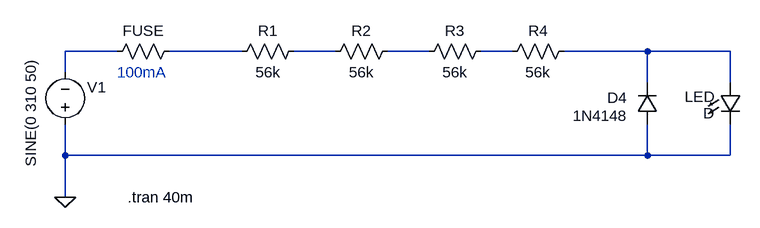
[diagram p0: schematic v1.0.asc]
v1.0.asc, the LTspice schematic file:
Version 4.1
SHEET 1 1084 680
WIRE -48 16 -128 16
WIRE 144 16 32 16
WIRE 288 16 224 16
WIRE 432 16 368 16
WIRE 560 16 512 16
WIRE 768 16 640 16
WIRE 896 16 768 16
WIRE -128 48 -128 16
WIRE 768 64 768 16
WIRE 896 64 896 16
WIRE -128 176 -128 128
WIRE 768 176 768 128
WIRE 768 176 -128 176
WIRE 896 176 896 128
WIRE 896 176 768 176
WIRE -128 240 -128 176
FLAG -128 240 0
SYMBOL voltage -128 144 R180
WINDOW 123 0 0 Left 0
WINDOW 39 0 0 Left 0
WINDOW 0 -63 73 Left 2
WINDOW 3 53 -50 VRight 2
SYMATTR InstName V1
SYMATTR Value SINE(0 310 50)
SYMBOL res 240 0 R90
WINDOW 0 0 56 VBottom 2
WINDOW 3 32 56 VTop 2
SYMATTR InstName R1
SYMATTR Value 56k
SYMBOL res 384 0 R90
WINDOW 0 0 56 VBottom 2
WINDOW 3 32 56 VTop 2
SYMATTR InstName R2
SYMATTR Value 56k
SYMBOL res 528 0 R90
WINDOW 0 0 56 VBottom 2
WINDOW 3 32 56 VTop 2
SYMATTR InstName R3
SYMATTR Value 56k
SYMBOL res 656 0 R90
WINDOW 0 0 56 VBottom 2
WINDOW 3 32 56 VTop 2
SYMATTR InstName R4
SYMATTR Value 56k
SYMBOL diode 784 128 R180
WINDOW 0 47 41 Left 2
WINDOW 3 46 13 Left 2
SYMATTR InstName D4
SYMATTR Value 1N4148
SYMBOL LED 880 64 R0
WINDOW 0 -54 22 Left 2
WINDOW 3 -26 47 Left 2
SYMATTR InstName LED
SYMBOL res 48 0 R90
WINDOW 0 0 56 VBottom 2
WINDOW 3 32 56 Invisible 2
SYMATTR InstName FUSE
SYMATTR Value 0
TEXT -32 240 Left 2 !.tran 40m
TEXT -48 48 Left 2 ;100mA

The netlist it stands for:
* v1.0.asc
V1 0 N001 SINE(0 310 50)
R1 N003 N002 56k
R2 N004 N003 56k
R3 N005 N004 56k
R4 N006 N005 56k
D4 0 N006 1N4148
D§LED N006 0 D
R§FUSE N002 N001 0
.model D D
.lib standard.dio
.tran 40m
* 100mA
.backanno
.end